# EAGLE design untitled (EAGLE 6.1)
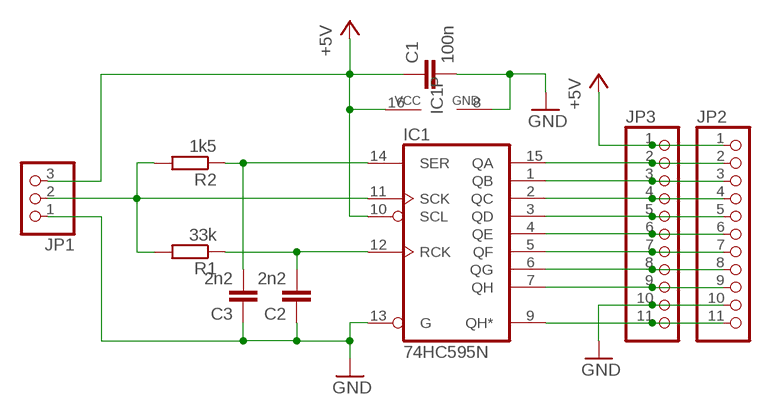
[diagram p0: schematic, sheet 1]

## Parts
C1  100n  C-EU025-025X050  [C025-025X050]
C2  2n2  C-EU025-025X050  [C025-025X050]
C3  2n2  C-EU025-025X050  [C025-025X050]
IC1  74HC595N  [DIL16]
JP1  PINHD-1X3  [1X03]
JP2  PINHD-1X11  [1X11]
JP3  PINHD-1X11  [1X11]
R1  33k  R-EU_0204/7  [0204/7]
R2  1k5  R-EU_0204/7  [0204/7]

## Nets
+5V: C1.1 IC1.10(SCL) IC1.16(VCC) JP1.3 JP2.1 JP3.1
GND: C1.2 C2.1 C3.1 IC1.8(GND) IC1.13(G) JP1.1 JP2.10 JP3.10
N$1: IC1.15(QA) JP2.2 JP3.2
N$2: IC1.1(QB) JP2.3 JP3.3
N$3: IC1.2(QC) JP2.4 JP3.4
N$4: C3.2 IC1.14(SER) R2.1
N$5: IC1.3(QD) JP2.5 JP3.5
N$6: C2.2 IC1.12(RCK) R1.1
N$7: IC1.4(QE) JP2.6 JP3.6
N$8: IC1.11(SCK) JP1.2 R1.2 R2.2
N$9: IC1.5(QF) JP2.7 JP3.7
N$10: IC1.6(QG) JP2.8 JP3.8
N$11: IC1.7(QH) JP2.9 JP3.9
N$12: IC1.9(QH*) JP2.11 JP3.11

## Library data of the parts
C1-C3 = rcl:C-EU: CAPACITOR, European symbol
IC1 = 74xx-eu:74*595: 8-bit SHIFT REGISTER, output latch
JP1 = pinhead:PINHD-1X3: PIN HEADER
JP2 JP3 = pinhead:PINHD-1X11: PIN HEADER
R1 R2 = rcl:R-EU_: RESISTOR, European symbol

## Board
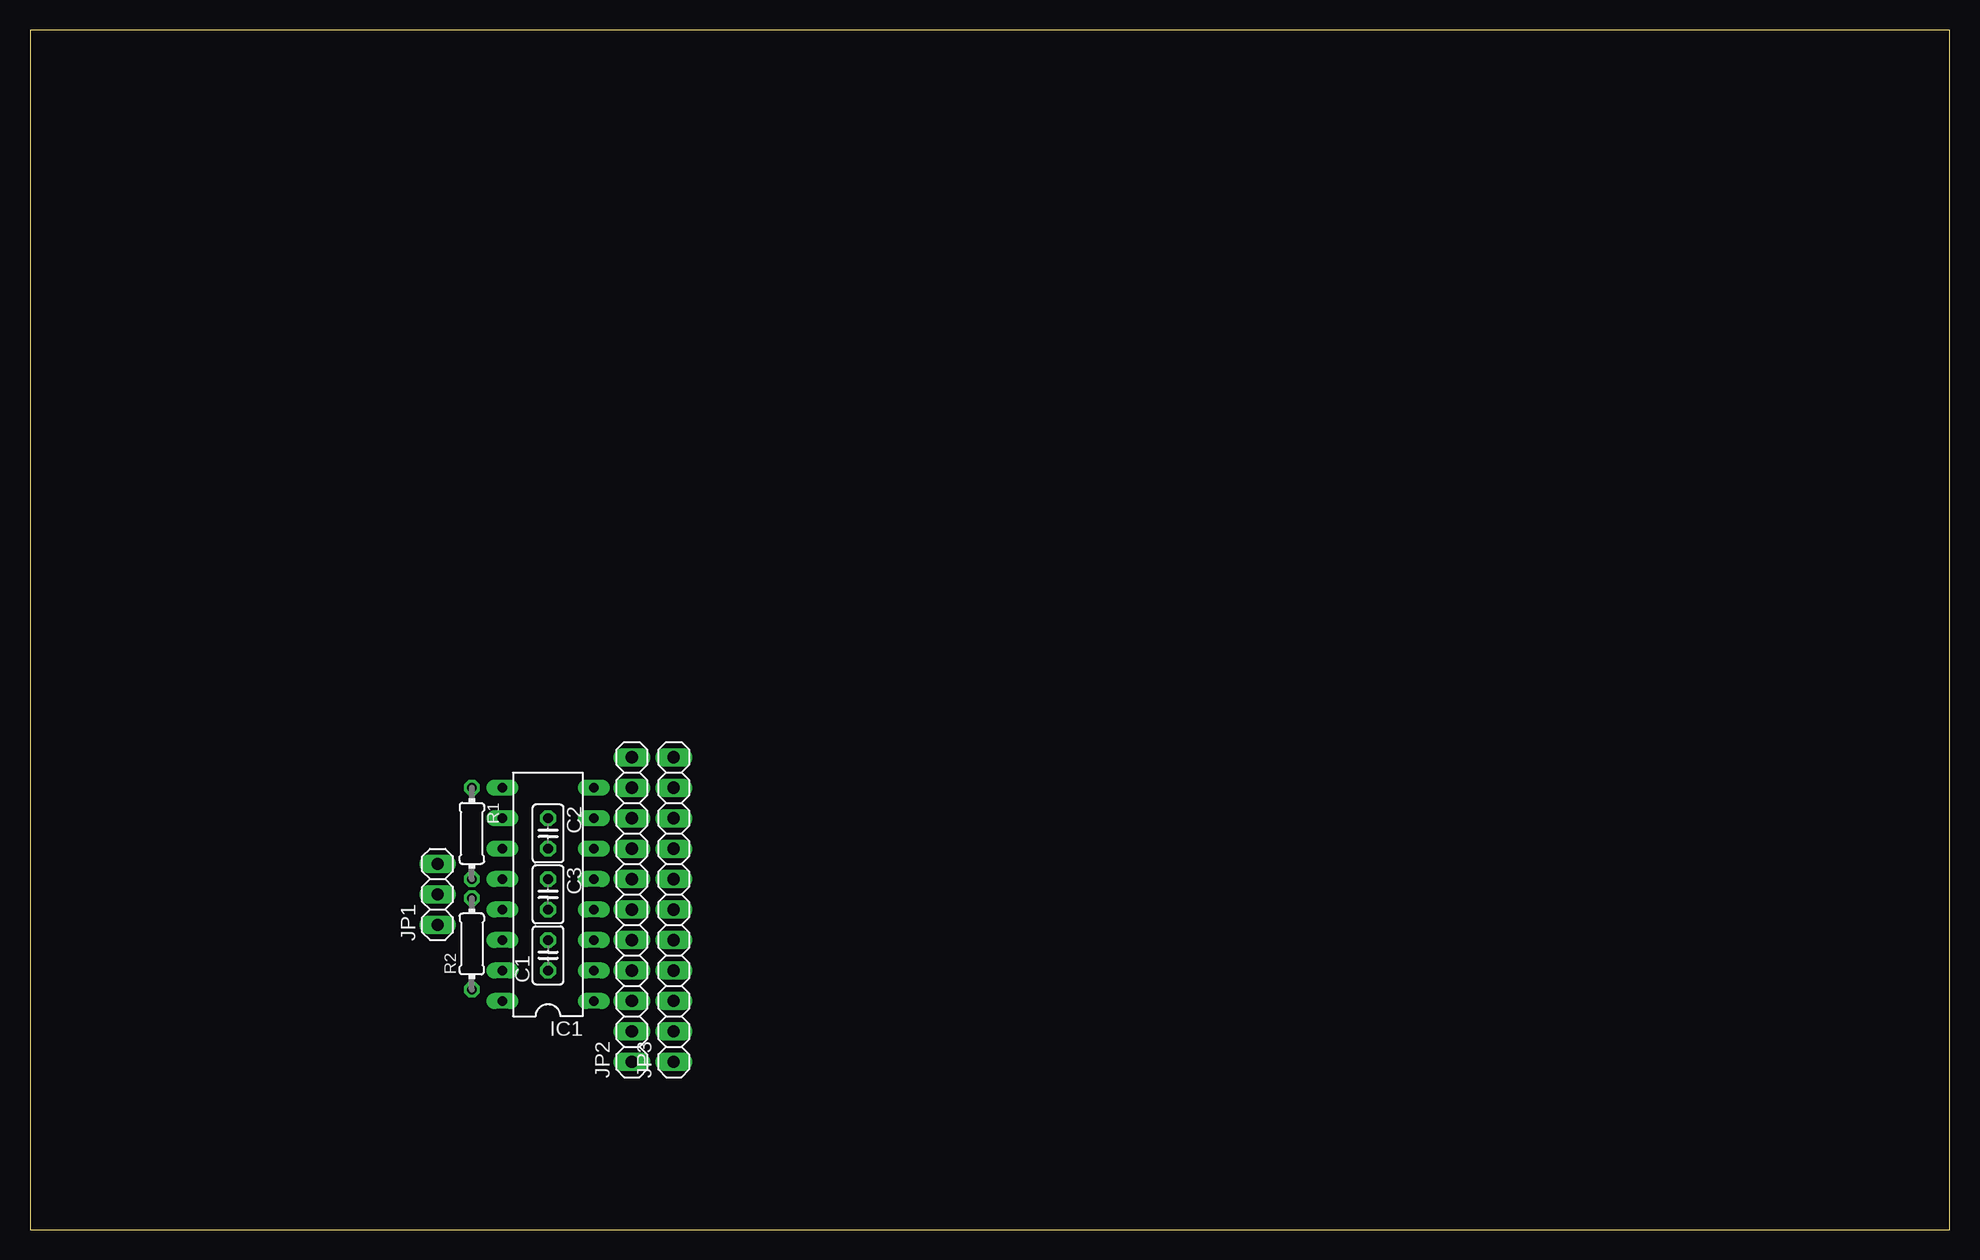
[diagram p1: board, top side]
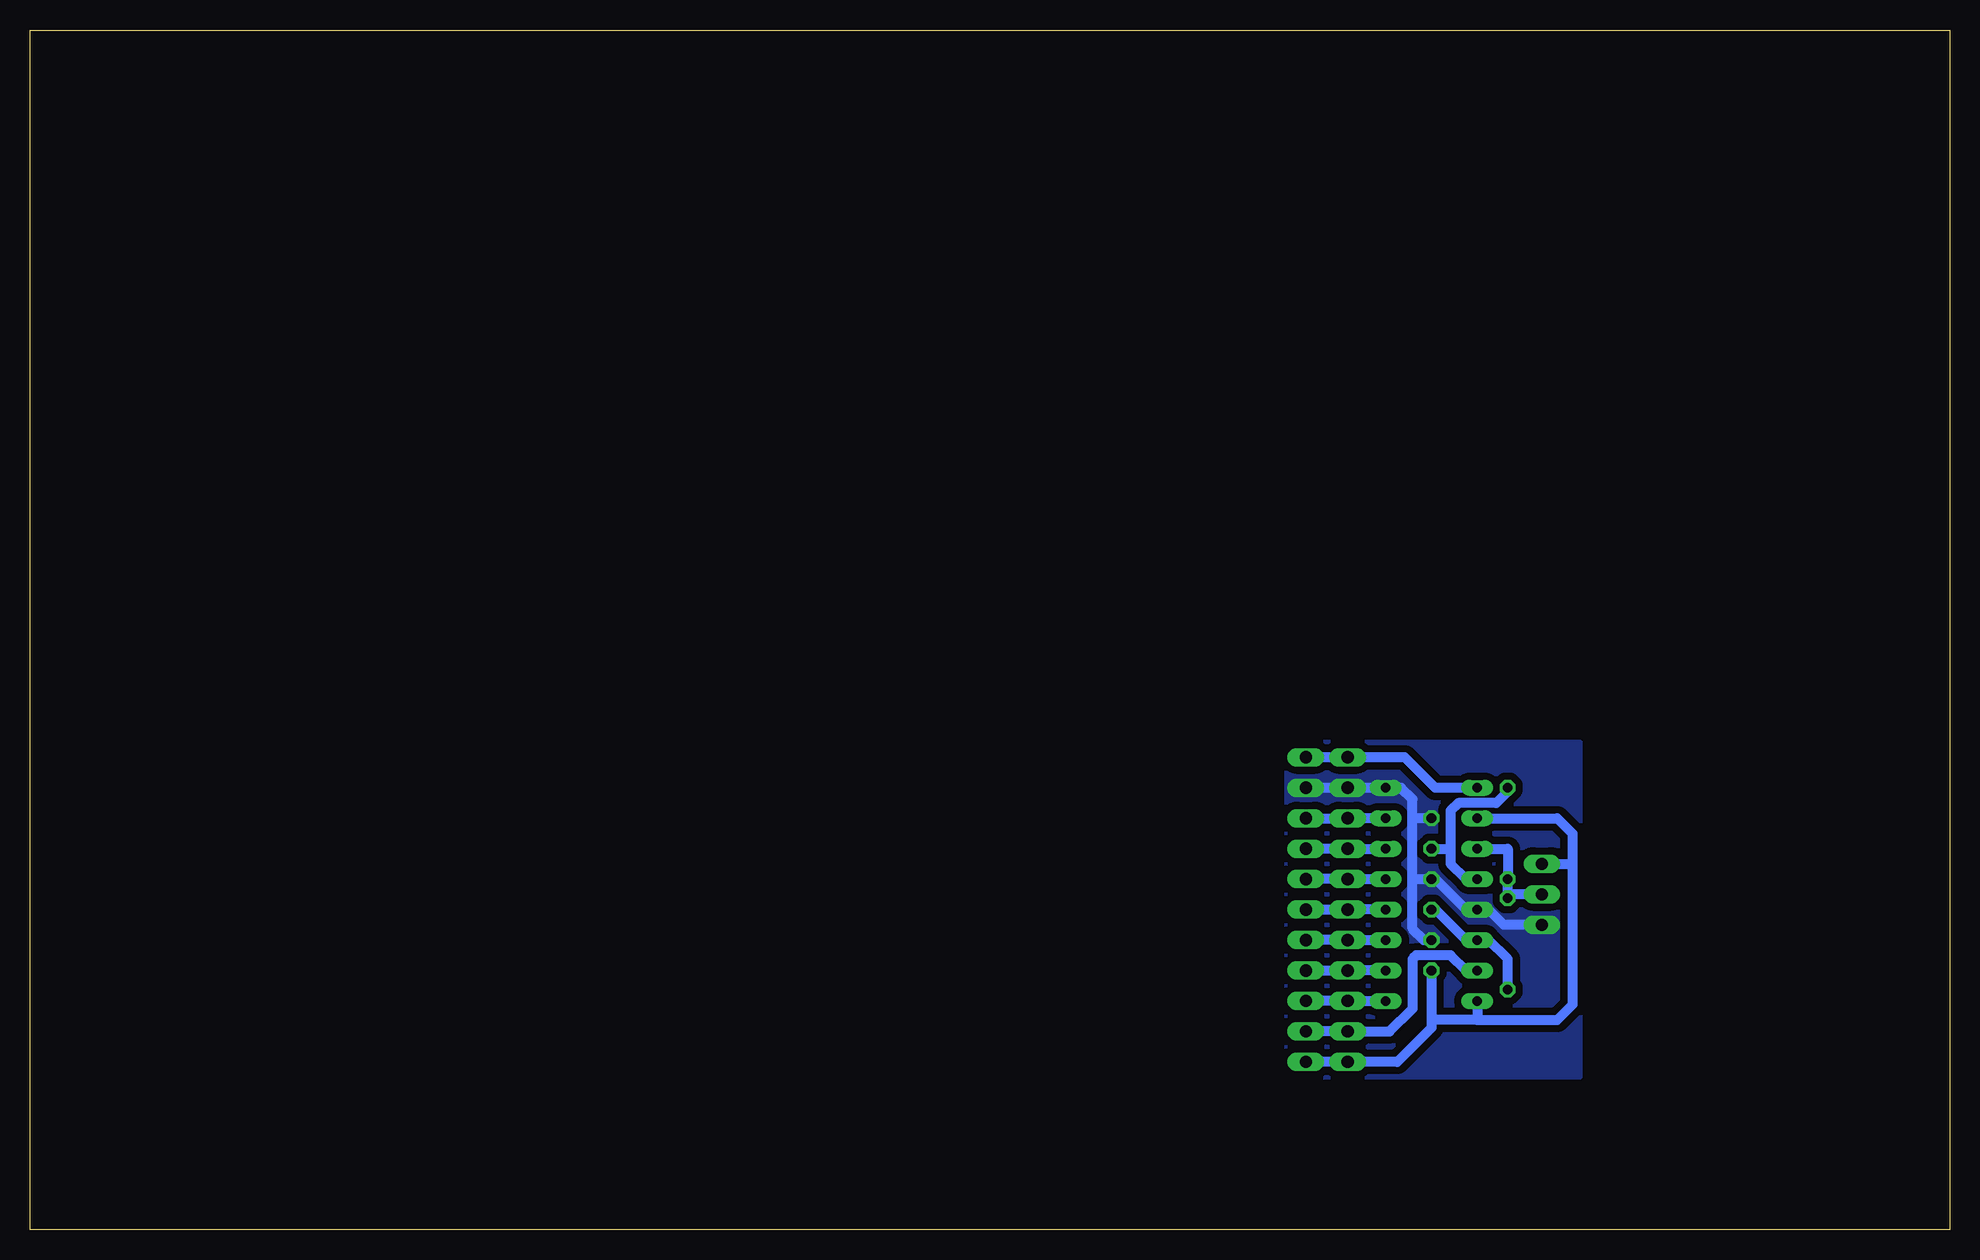
[diagram p2: board, bottom side, seen from below]

Size 160 x 100 mm. Coordinates in mm from the lower left corner, seen from the top.
Outline: 0,0 160,0 160,100 0,100 0,0
Copper layers (1*16): Top 0.035mm / dielectric 1.5mm / Bottom 0.035mm
Design rules: minimum track width 10mil, minimum drill 24mil, track to track 8mil, track to pad 8mil, pad to pad 8mil, via to via 8mil, smd to smd 8mil, copper to edge 40mil, drill to drill 8mil, minimum pad ring 10mil, minimum via ring 8mil, stop-mask expansion 4mil, vias tented up to drill 0mil, thermal gap 10mil

### Footprints (pad centres in the part's own frame; a part is rotated, then mirrored left to right if it is on the bottom)
C025-025X050 = drill 0.813 octagon: 1 -1.27,0; 2 1.27,0
DIL16 = drill 0.813 long: 1 -8.89,-3.81; 2 -6.35,-3.81; 3 -3.81,-3.81; 4 -1.27,-3.81; 5 1.27,-3.81; 6 3.81,-3.81; 7 6.35,-3.81; 8 8.89,-3.81; 9 8.89,3.81; 10 6.35,3.81; 11 3.81,3.81; 12 1.27,3.81; 13 -1.27,3.81; 14 -3.81,3.81; 15 -6.35,3.81; 16 -8.89,3.81
1X03 = drill 1.016 long: 1 -2.54,0; 2 0,0; 3 2.54,0
1X11 = drill 1.016 long: 1 -12.7,0; 2 -10.16,0; 3 -7.62,0; 4 -5.08,0; 5 -2.54,0; 6 0,0; 7 2.54,0; 8 5.08,0; 9 7.62,0; 10 10.16,0; 11 12.7,0
0204/7 = drill 0.813 octagon: 1 -3.81,0; 2 3.81,0

### Placement (x,y rotation side)
C1  43.18,22.86 90 top
C2  43.18,33.02 270 top
C3  43.18,27.94 270 top
IC1  43.18,27.94 90 top
JP1  33.97,27.94 90 top
JP2  50.16,26.67 90 top
JP3  53.66,26.67 90 top
R1  36.83,33.02 270 top
R2  36.83,23.81 90 top

### Tracks (layer width: path | path; a pad name or v marks a point on that pad's centre or on a via)
+5V
  Bottom 0.813: IC1.10 32.7,34.29 31.43,33.02 31.43,30.48 | 31.43,30.48 31.43,18.73 32.7,17.46 39.37,17.46 | JP1.3 31.43,30.48 | IC1.16 39.37,17.46 | C1.1 43.18,17.46 | 43.18,17.46 43.18,16.83 46.04,13.97 JP2.1 JP3.1 | 39.37,17.46 43.18,17.46
GND
  Bottom 0.813: 44.77,29.21 44.77,34.29 | 44.77,34.29 44.77,35.88 45.72,36.83 IC1.8 JP2.10 JP3.10 | C2.1 44.77,34.29 | C1.2 43.81,24.13 44.77,25.08 44.77,29.21 | 44.77,29.21 C3.1 42.86,29.21 40.32,26.67 IC1.13 38.42,26.67 37.15,25.4 JP1.1
  pour Bottom (isolate 0.61, no thermals): 55.24,40.64 30.8,40.64 30.8,12.7 55.24,12.7
N$1
  Bottom 0.813: IC1.15 40.32,21.59 41.59,22.86 44.45,22.86 44.77,22.54 44.77,18.41 46.67,16.51 JP2.2 JP3.2
N$2
  Bottom 0.813: JP3.3 JP2.3 IC1.1
N$3
  Bottom 0.813: JP3.4 JP2.4 IC1.2
N$4
  Bottom 0.813: C3.2 42.86,26.67 40.32,24.13 IC1.14 38.42,24.13 36.83,22.54 R2.1
N$5
  Bottom 0.813: JP3.5 JP2.5 IC1.3
N$6
  Bottom 0.813: IC1.12 40.32,29.21 41.59,30.48 41.59,31.75 | 41.59,31.75 41.59,34.92 40.96,35.56 37.78,35.56 36.83,36.51 R1.1 | C2.2 41.59,31.75
N$7
  Bottom 0.813: JP3.6 JP2.6 IC1.4
N$8
  Bottom 0.813: R2.2 36.83,27.94 | 36.83,27.94 R1.2 36.83,31.75 IC1.11 | JP1.2 36.83,27.94
N$9
  Bottom 0.813: JP3.7 JP2.7 IC1.5
N$10
  Bottom 0.813: JP3.8 JP2.8 IC1.6
N$11
  Bottom 0.813: JP3.9 JP2.9 IC1.7
N$12
  Bottom 0.813: IC1.9 42.86,36.83 45.4,39.37 JP2.11 JP3.11